# Altium schematic sheet BMP180 MODULE_2023-11-20.schdoc
size 55 x 36 mm
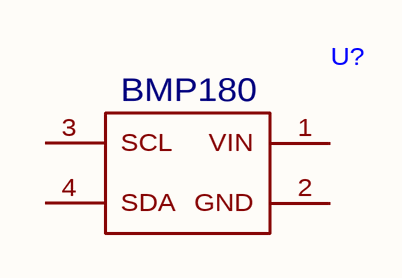
[diagram p0: BMP180 MODULE_2023-11-20.schdoc]

## Parts
U?  (no value)  [BMP180]

## Nets

Not connected (* = marked no-connect by the designer): U? 1(VIN) 2(GND) 3(SCL) 4(SDA)

## Notes on the sheet
- (in symbol BMP180 MODULE) BMP180

## Library data of the parts
U? = BMP180 MODULE